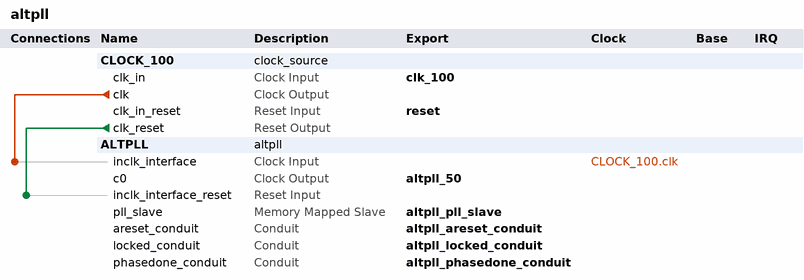
[diagram p0: system contents]
# Platform Designer (Qsys) system altpll, Cyclone IV E EP4CE55F23C6
# Parameters at their usual value, and those the tool derives, are not listed.
package require -exact qsys 13.0
create_system altpll
set_project_property DEVICE_FAMILY {Cyclone IV E}
set_project_property DEVICE EP4CE55F23C6

add_instance CLOCK_100 clock_source 13.0
set_instance_parameter_value CLOCK_100 clockFrequency 50000000

add_instance ALTPLL altpll 13.0
set_instance_parameter_value ALTPLL INCLK0_INPUT_FREQUENCY 10000
set_instance_parameter_value ALTPLL CLK0_MULTIPLY_BY 1
set_instance_parameter_value ALTPLL CLK0_DIVIDE_BY 2
set_instance_parameter_value ALTPLL PORT_clk1 PORT_UNUSED
set_instance_parameter_value ALTPLL PORT_clk2 PORT_UNUSED
set_instance_parameter_value ALTPLL PORT_clk3 PORT_UNUSED
set_instance_parameter_value ALTPLL PORT_ARESET PORT_UNUSED
set_instance_parameter_value ALTPLL PORT_LOCKED PORT_USED

# connections
add_connection CLOCK_100.clk ALTPLL.inclk_interface clock
add_connection CLOCK_100.clk_reset ALTPLL.inclk_interface_reset reset

# exported interfaces
add_interface clk_100 clock sink
set_interface_property clk_100 EXPORT_OF CLOCK_100.clk_in
add_interface reset reset sink
set_interface_property reset EXPORT_OF CLOCK_100.clk_in_reset
add_interface altpll_areset_conduit conduit end
set_interface_property altpll_areset_conduit EXPORT_OF ALTPLL.areset_conduit
add_interface altpll_locked_conduit conduit end
set_interface_property altpll_locked_conduit EXPORT_OF ALTPLL.locked_conduit
add_interface altpll_phasedone_conduit conduit end
set_interface_property altpll_phasedone_conduit EXPORT_OF ALTPLL.phasedone_conduit
add_interface altpll_50 clock source
set_interface_property altpll_50 EXPORT_OF ALTPLL.c0
add_interface altpll_pll_slave avalon slave
set_interface_property altpll_pll_slave EXPORT_OF ALTPLL.pll_slave

set_interconnect_requirement {$system} qsys_mm.clockCrossingAdapter HANDSHAKE
set_interconnect_requirement {$system} qsys_mm.maxAdditionalLatency 1

save_system altpll.qsys
